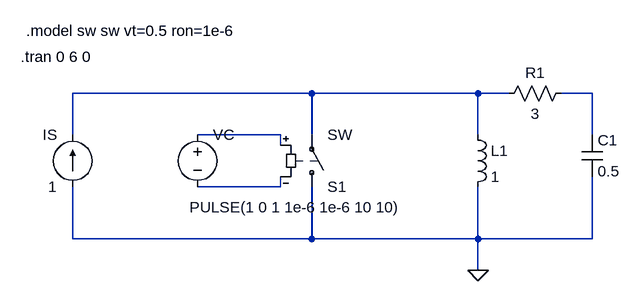
[diagram p0: schematic exercise2_assignment4.asc]
exercise2_assignment4.asc, the LTspice schematic file:
Version 4
SHEET 1 880 680
WIRE 352 64 -16 64
WIRE 608 64 352 64
WIRE 656 64 608 64
WIRE 784 64 736 64
WIRE -16 128 -16 64
WIRE 304 128 176 128
WIRE 352 128 352 64
WIRE 608 128 608 64
WIRE 784 128 784 64
WIRE 304 144 304 128
WIRE 304 208 304 192
WIRE 304 208 176 208
WIRE -16 288 -16 208
WIRE 352 288 352 208
WIRE 352 288 -16 288
WIRE 608 288 608 208
WIRE 608 288 352 288
WIRE 784 288 784 192
WIRE 784 288 608 288
WIRE 608 336 608 288
FLAG 608 336 0
SYMBOL current -16 208 R180
WINDOW 0 24 80 Left 2
WINDOW 3 24 0 Left 2
SYMATTR InstName IS
SYMATTR Value 1
SYMBOL voltage 176 112 R0
WINDOW 3 -12 127 Left 2
SYMATTR Value PULSE(1 0 1 1e-6 1e-6 10 10)
SYMATTR InstName VC
SYMBOL sw 352 224 M180
SYMATTR InstName S1
SYMBOL ind 592 112 R0
SYMATTR InstName L1
SYMATTR Value 1
SYMBOL cap 768 128 R0
SYMATTR InstName C1
SYMATTR Value 0.5
SYMBOL res 752 48 R90
WINDOW 0 0 56 VBottom 2
WINDOW 3 32 56 VTop 2
SYMATTR InstName R1
SYMATTR Value 3
TEXT -88 -32 Left 2 !.model sw sw vt=0.5 ron=1e-6
TEXT -96 8 Left 2 !.tran 0 6 0

The netlist it stands for:
* exercise2_assignment4.asc
IS 0 N001 1
VC N003 N004 PULSE(1 0 1 1e-6 1e-6 10 10)
S1 0 N001 N003 N004 SW
L1 N001 0 1
C1 N002 0 0.5
R1 N002 N001 3
.model sw sw vt=0.5 ron=1e-6
.tran 0 6 0
.backanno
.end